# Altium schematic sheet Sheet_V2.SchDoc: Humidity Fan Controller
size A3; Author: Grzegorz Jabłoński; Revision: V2.0; SheetNumber: 1; SheetTotal: 1
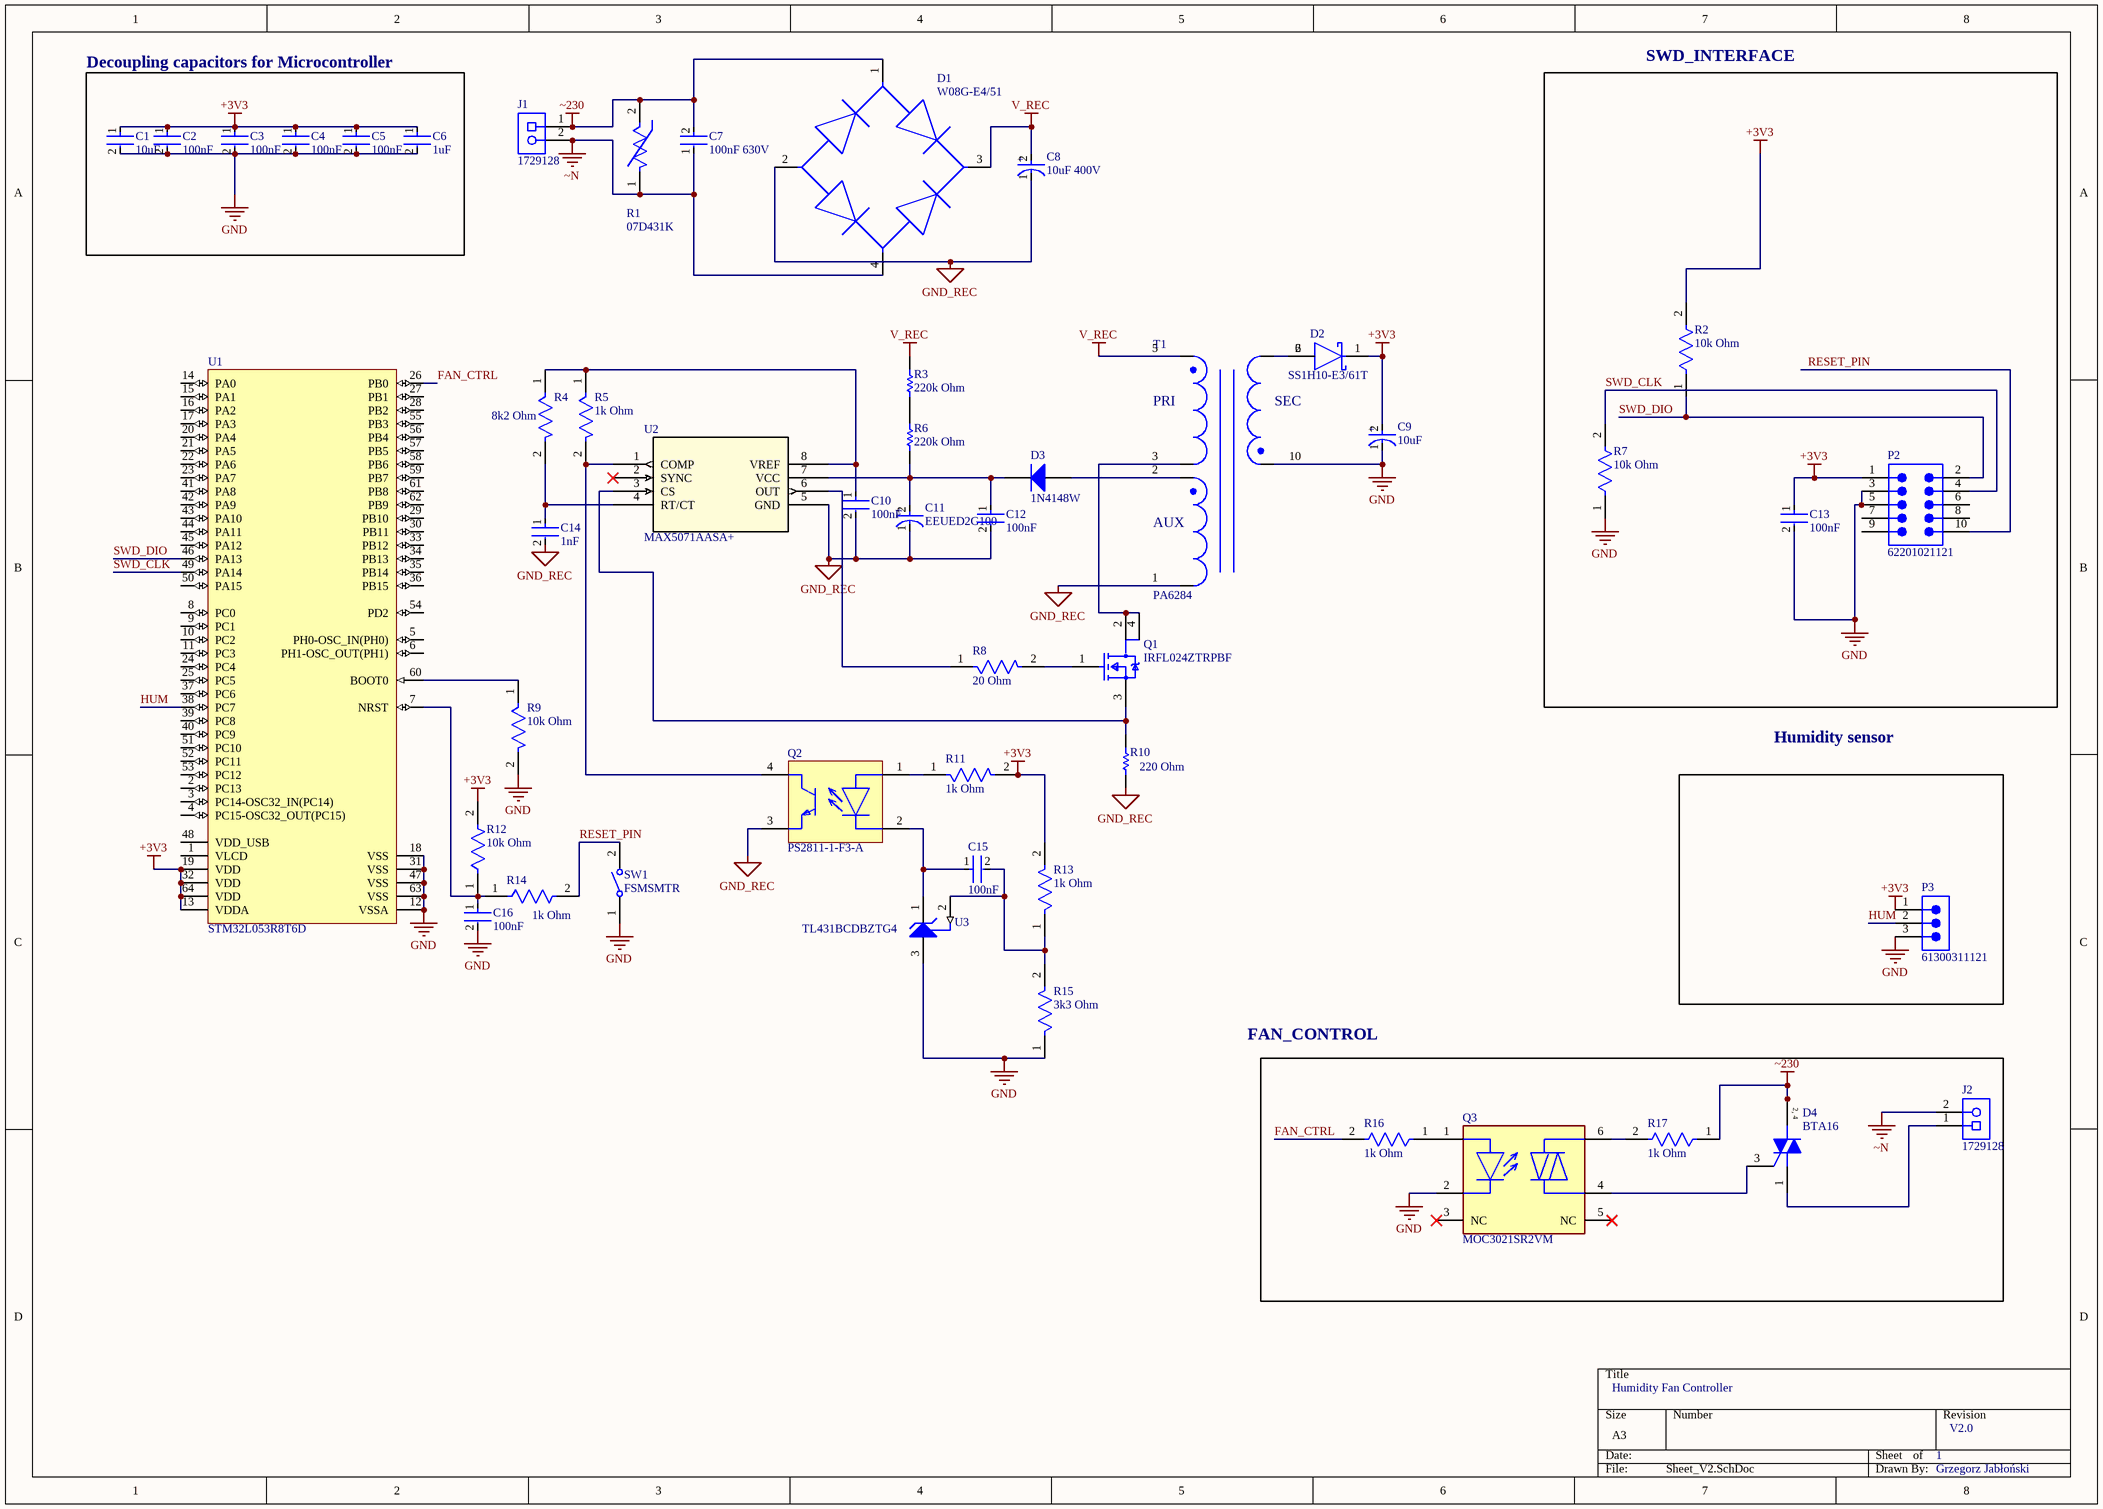
[diagram p0: Sheet_V2.SchDoc]

## Parts
C1  10uF  [FP-CC0805-0_85-MFG]
C2  100nF  [FP-CC0805-0_85-MFG]
C3  100nF  [FP-CC0805-0_85-MFG]
C4  100nF  [FP-CC0805-0_85-MFG]
C5  100nF  [FP-CC0805-0_85-MFG]
C6  1uF  [FP-CC0805-0_85-MFG]
C7  100nF 630V  [FP-BFC233620104-MFG]
C8  10uF 400V  [FP-RAD-TH-D_10_0_5-L_20_2-MFG]
C9  10uF  [FP-RAD-TH-D_6_3_0_5-L_7_1-MFG]
C10  100nF  [FP-CC0805-0_85-MFG]
C11  EEUED2G100  [FP-RAD-TH-D_10_0_5-L_20_2-MFG]
C12  100nF  [FP-CC0805-0_85-MFG]
C13  100nF  [FP-CC0805-0_85-MFG]
C14  1nF  [FP-CC0805-0_85-MFG]
C15  100nF  [FP-CC0805-0_85-MFG]
C16  100nF  [FP-CC0805-0_85-MFG]
D1  W08G-E4/51  [FP-WOG-MFG]
D2  SS1H10-E3/61T  [FP-95400-MFG]
D3  1N4148W  [DIOD-SOD123-2_V]
D4  BTA16  [ONSC-SOT-223-4-318E-04_V]
J1  1729128  [PHOE-1729128-2_V]
J2  1729128  [PHOE-1729128-2_V]
P2  62201021121  [62201021121]
P3  61300311121  [61300311121]
Q1  IRFL024ZTRPBF  [FP-PG-SOT223-3-MFG]
Q2  PS2811-1-F3-A  [SOP127P700X210_HS-5_SO4-Opto2_N]
Q3  MOC3021SR2VM  [FP-646BY-MFG]
R1  07D431K  [FP-B72207S0110K101-MFG]
R2  10k Ohm  [FP-RMCF0805-MFG]
R3  220k Ohm  [RESC3216X70X50NL20T25]
R4  8k2 Ohm  [FP-RMCF0805-MFG]
R5  1k Ohm  [FP-RMCF0805-MFG]
R6  220k Ohm  [RESC3216X70X50NL20T25]
R7  10k Ohm  [FP-RMCF0805-MFG]
R8  20 Ohm  [FP-RMCF0805-MFG]
R9  10k Ohm  [FP-RMCF0805-MFG]
R10  220 Ohm  [RESC3216X70X50NL05T20]
R11  1k Ohm  [FP-RMCF0805-MFG]
R12  10k Ohm  [FP-RMCF0805-MFG]
R13  1k Ohm  [FP-RMCF0805-MFG]
R14  1k Ohm  [FP-RMCF0805-MFG]
R15  3k3 Ohm  [FP-RMCF0805-MFG]
R16  1k Ohm  [FP-RMCF0805-MFG]
R17  1k Ohm  [FP-RMCF0805-MFG]
SW1  FSMSMTR  [TECO-FSMSMTR_V]
T1  PA6284  [ALD]
U1  STM32L053R8T6D  [STM-LQFP64_L]
U2  MAX5071AASA+  [21-0041_S8+4_MXM]
U3  TL431BCDBZTG4  [TI-DBZ3_N]

## Blocks framed on the sheet
Decoupling capacitors for Microcontroller: C1-C6
SWD_INTERFACE: C13 P2 R2 R7

## Nets
+3V3: C1.1 C2.1 C3.1 C4.1 C5.1 C6.1 C9.2(A) C13.1 D2.1(C) P2.1 P3.1 R2.2 R11.2 R12.2 R13.2 U1.13(VDDA) U1.19(VDD) U1.32(VDD) U1.64(VDD)
GND: C1.2 C2.2 C3.2 C4.2 C5.2 C6.2 C9.1(C) C13.2 C16.2 P2.3 P2.5 P3.3 Q3.2(C) R7.1 R9.2 R15.1 SW1.1 T1.10 U1.12(VSSA) U1.18(VSS) U1.31(VSS) U1.47(VSS) U1.63(VSS) U3.3(ANODE)
GND_REC: C8.1(C) C10.2 C11.1(C) C12.2 C14.2 D1.2(+) Q2.3(E) R10.1 T1.1 U2.5(GND)
V_REC: C8.2(A) D1.3(-) R3.2 T1.5
~230: C7.2 D1.1(1_~) D4.2(MT2) D4.4(MT2) J1.1 R1.2 R17.1
~N: C7.1 D1.4(2_~) J1.2 J2.2 R1.1
FAN_CTRL: R16.2 U1.26(PB0)
HUM: P3.2 U1.38(PC7)
RESET_PIN: P2.10 R14.2 SW1.2
SWD_CLK: P2.4 R7.2 U1.49(PA14)
SWD_DIO: P2.2 R2.1 U1.46(PA13)
NetC10_1: C10.1 R4.1 R5.1 U2.8(VREF)
NetC11_2: C11.2(A) C12.1 D3.2(K) R6.1 U2.7(VCC)
NetC14_1: C14.1 R4.2 U2.4(RT/CT)
NetC15_1: C15.1 Q2.2(C) U3.1(CATHODE)
NetC15_2: C15.2 R13.1 R15.2 U3.2(REF)
NetC16_1: C16.1 R12.1 R14.1 U1.7(NRST)
NetD2_2: D2.2(A) T1.6
NetD3_1: D3.1(A) T1.2
NetD4_1: D4.1(MT1) J2.1
NetD4_3: D4.3(G) Q3.4(1_MAIN_TERM)
NetQ1_1: Q1.1(GATE) R8.2
NetQ1_2: Q1.2(DRAIN) Q1.4(DRAIN) T1.3
NetQ1_3: Q1.3(SOURCE) R10.2 U2.3(CS)
NetQ2_1: Q2.1(A) R11.1
NetQ2_4: Q2.4(C) R5.2 U2.1(COMP)
NetQ3_1: Q3.1(A) R16.1
NetQ3_6: Q3.6(2_MAIN_TERM) R17.2
NetR3_1: R3.1 R6.2
NetR8_1: R8.1 U2.6(OUT)
NetR9_1: R9.1 U1.60(BOOT0)

Not connected (* = marked no-connect by the designer): P2 6 7 8 9; Q3 3(NC)* 5(NC)*; U1 1(VLCD) 2(PC13) 3(PC14-OSC32_IN(PC14)) 4(PC15-OSC32_OUT(PC15)) 5(PH0-OSC_IN(PH0)) 6(PH1-OSC_OUT(PH1)) 8(PC0) 9(PC1) 10(PC2) 11(PC3) 14(PA0) 15(PA1) 16(PA2) 17(PA3) 20(PA4) 21(PA5) 22(PA6) 23(PA7) 24(PC4) 25(PC5) 27(PB1) 28(PB2) 29(PB10) 30(PB11) 33(PB12) 34(PB13) 35(PB14) 36(PB15) 37(PC6) 39(PC8) 40(PC9) 41(PA8) 42(PA9) 43(PA10) 44(PA11) 45(PA12) 48(VDD_USB) 50(PA15) 51(PC10) 52(PC11) 53(PC12) 54(PD2) 55(PB3) 56(PB4) 57(PB5) 58(PB6) 59(PB7) 61(PB8) 62(PB9); U2 2(SYNC)*

## Notes on the sheet
- Humidity sensor
- FAN_CONTROL
- (in symbol CMP-1070-00032-1) 2, 4
- (in symbol CMP-05427-000412-1) +
- (in symbol CMP-05427-001613-1) +
- (in symbol PA6284) PRI; SEC; AUX

## Library data of the parts
C1 C6 C14 = CMP-2100-03606-3: CAP CER 0.1UF 50V X7R 0805; Manufacturer Part Number: CC0805KRX7R9BB104; Manufacturer: Yageo; Tolerance: 0.1; Capacitance: 100 nF; Value: 100 nF; Material: Ceramic; Device Class L1: Passive Components; ComponentLink2Description: Datasheet; Package: CC0805-0.85; Digikey Description: CAP CER 0.1UF 50V X7R 0805; Device Class L3: Ceramic Capacitors; Temperature: -30°C to +85°C; Temperature Characteristic: X7R; Voltage Rating: 50 V; Height: 0.95mm; RoHS: TRUE; Ipc Land Pattern Name: CAPC200125X85; Device Class L2: Capacitors; Category: Cap; Temperature Range Low: -30°C; Temperature Range High: +85°C; Mouser Description: Multilayer Ceramic Capacitors MLCC - SMD/SMT 100nF 50V X7R 10%; Footprint Url: http://www.yageo.com/exep/pages/download/literatures/UPY-C_GEN_24.pdf; Automotive: No; Octopart: https://octopart.com/cc0805krx7r9bb104-yageo-192993; Lead Free: Yes; ComponentLink2URL: http://www.yageo.com/documents/recent/UPY-GPHC_Y5V_6.3V-to-50V_8.pdf
C2-C5 C10 C12 C13 C15 C16 = CMP-2100-03606-3: CAP CER 0.1UF 50V X7R 0805; Manufacturer Part Number: CC0805KRX7R9BB104; Manufacturer: Yageo; Tolerance: 0.1; Material: Ceramic; Device Class L1: Passive Components; ComponentLink2Description: Datasheet; Package: CC0805-0.85; Digikey Description: CAP CER 0.1UF 50V X7R 0805; Capacitance: 100 nF; Device Class L3: Ceramic Capacitors; Value: 100 nF; Temperature: -30°C to +85°C; Temperature Characteristic: X7R; Voltage Rating: 50 V; Height: 0.95mm; RoHS: TRUE; Ipc Land Pattern Name: CAPC200125X85; Device Class L2: Capacitors; Category: Cap; Temperature Range Low: -30°C; Temperature Range High: +85°C; Mouser Description: Multilayer Ceramic Capacitors MLCC - SMD/SMT 100nF 50V X7R 10%; Footprint Url: http://www.yageo.com/exep/pages/download/literatures/UPY-C_GEN_24.pdf; Automotive: No; Octopart: https://octopart.com/cc0805krx7r9bb104-yageo-192993; Lead Free: Yes; ComponentLink2URL: http://www.yageo.com/documents/recent/UPY-GPHC_Y5V_6.3V-to-50V_8.pdf
C7 = CMP-02419-000009-1: CAP FILM 0.1UF 20% 630VDC RADIAL; Insulation Resistance: 15GR; Voltage: 250V; Voltage Rating (AC): 310V; Lead Diameter: 0.6mm; Dielectric: PP; Lead Free: Lead Free; Height - Seated (Max): 0.433inch; Radiation Hardening: No; Lead Pitch: 15mm; Width: 0.197inch; Height: 12mm; Package Quantity: 1000; Capacitance: 100nF; Packaging: Bulk; Termination: PC Pins; Case/Package: Radial; Contact Plating: Tin; Length: 17.5mm; Diameter: 6mm; Max Operating Temperature: 110°C; Mount: Through Hole; Min Operating Temperature: -55°C; Depth: 5mm; RoHS Compliant: Yes; Series: MKP336 2; Voltage Rating (DC): 630V; Tolerance: 20%; Construction: RADIAL; Dielectric Material: PP
C8 C11 = CMP-05427-001613-1: Aluminum Electrolytic Capacitors (Radial Lead Type) 10uF ±20% 400V; Lead Diameter: 0.6mm; Life (Hours): 8000Hour; Ripple Current (AC): 300mA; Dissipation Factor: 0.24%; Dielectric Material: Aluminium; Polarity: Polar; Voltage: 400V; Number of Pins: 2; Height: 20mm; Case/Package: Radial; REACH SVHC: No SVHC; Max Operating Temperature: 105°C; Construction: RADIAL; Voltage Rating (DC): 400V; Tolerance: 20%; Voltage Rating: 400V; Contact Plating: Tin; Ripple Current: 300mA; Min Operating Temperature: -25°C; Packaging: Bulk; Lead Free: Lead Free; Diameter: 10mm; Height - Seated (Max): 0.787inch; Radiation Hardening: No; Capacitance: 10uF; Termination: Radial; Length: 20mm; Series: ED; Package Quantity: 200; Mount: Through Hole; Lead Pitch: 5mm; RoHS Compliant: Yes
C9 = CMP-05427-000412-1: Aluminum Electrolytic Capacitors (Radial Lead Type) 15uF ±20% 35V; Ripple Current: 50mA; Ripple Current (AC): 35mA; Polarity: Polar; Leakage Current: 5.3uA; Life (Hours): 1000Hour; Min Operating Temperature: -55°C; Tolerance: 20%; Termination: Radial; RoHS Compliant: Yes; Mount: Through Hole; Package Quantity: 200; Series: GA; Lead Pitch: 2.5mm; Voltage Rating: 35V; Diameter: 6.3mm; REACH SVHC: No SVHC; Capacitance: 15uF; Packaging: Bulk; Case/Package: Radial; Number of Pins: 2; Height: 7mm; Max Operating Temperature: 105°C; Radiation Hardening: No; Voltage Rating (DC): 35V; Construction: RADIAL; Voltage: 35V; Length: 7mm; Height - Seated (Max): 0.276inch
D1 = CMP-00030-42174390-1: W08G-E4/51 Diode Rectifier Bridge Single 800V 1.5A 4-Pin Case WOG Bulk; Peak Reverse Current: 5µA; Number of Elements: 1; Forward Voltage: 1V; Max Surge Current: 50A; Capacitance: 14pF; Lead Free: Lead Free; Element Configuration: Single; Number of Pins: 4; Breakdown Voltage: 800V; Average Rectified Current: 1.5A; Width: 8.84mm; Max Repetitive Reverse Voltage (Vrrm): 800V; RoHS: Compliant; Length: 9.86mm; REACH SVHC: Unknown; NexarPartId: 42174390; Forward Current: 1.5A; Radiation Hardening: No; Height: 5.6mm; Diameter: 9mm; Min Operating Temperature: -55°C; Peak Non-Repetitive Surge Current: 50A; Schedule B: 8541100080, 8541100080; Max Reverse Leakage Current: 5µA; Max Operating Temperature: 150°C; Mount: Through Hole; Output Current: 1.5A
D2 = CMP-02539-000016-1: DIODE SCHOTTKY 100V 1A DO214AC; Manufacturer: Vishay; Standoff Height: 0mm; Max Junction Temp: +175°C; Max Surge Forward Current: 50A; Peak Reverse Current: 1uA; Package: 95400; Octopart: https://octopart.com/ss1h10-e3%2F61t-vishay-39552861; Device Class L2: Diodes; Automotive: No; Height: 2.29mm; Category: Diode; ComponentLink2Description: Datasheet; Forward Current: 1A; Reverse Voltage: 100V; Temperature Range High: +175°C; Lead Free: Yes; Device Class L3: Schottky Diodes; Manufacturer Part Number: SS1H10-E3/61T; ComponentLink2URL: http://www.vishay.com/docs/88747/ss1h9.pdf; Mouser Description: Schottky Diodes & Rectifiers 1.0 Amp 100 Volt; RoHS: TRUE; Digikey Description: DIODE SCHOTTKY 100V 1A DO214AC; Footprint Url: http://www.vishay.com/docs/95400/sma.pdf; Device Class L1: Discrete Semiconductors; Max Repetitive Reverse Voltage: 100V; Temperature: to +175°C
D3 = CMP-2000-04932-2: Fast Switching Diode, 100 V, 0.15 A, -65 to 150 degC, 2-Pin?SOD123, RoHS, Tape and Reel; Recovery Time: 4ns; Brand: DiodesIncorporated; Unit Weight: 0.000353oz; Max Surge Current: 2A; Peak Reverse Voltage: 100V; Ir - Reverse Current: 1uA; Vf - Forward Voltage: 1.25V; Configuration: Single; If - Forward Current: 0.15A; Product Category: Diodes-GeneralPurpose,Power,Switching; Operating Temperature Range: -65Cto+150C; Packaging: Reel; Manufacturer URL: http://www.diodes.com/; Maximum Operating Temperature: +150C; Height: 1.25mm; Minimum Operating Temperature: -65C; Product: SwitchingDiodes; Package URL: http://www.diodes.com/datasheets/ds18004.pdf; Type: SwitchingDiode; Package Reference: SOD123-2; Width: 1.7mm; Datasheet URL: http://www.farnell.com/datasheets/1915529.pdf; Datasheet Version: Rev. 24-2, 10/2013; Series: 1N4148; Factory Pack Quantity: 3000; Length: 2.85mm; RoHS: True; Manufacturer: DiodesIncorporated; Mounting Style: SMD/SMT; Package / Case: SOD-123
D4 = CMP-1070-00032-1: Sensitive Gate Triac Series, Silicon Bidirectional Thyristor, 4-Pin SOT-223, Pb-Free, Tape and Reel; Manufacturer: On Semiconductor; PartNumber: Z0107MNT1G; ITSM Max (A): 8; IT(RMS) Max (A): 1; PackageVersion: Rev. N, 08/2009; ComponentLink3URL: http://www.onsemi.com/pub_link/Collateral/318E-04.PDF; Packing: Tape and Reel; ComponentLink1Description: Manufacturer URL; ComponentLink3Description: Package Specification; DatasheetVersion: Rev. 3; ComponentLink2Description: Datasheet; PackageDescription: 4-Pin Small Outline Transistor, Body 6.5 x 3.5 mm, Pitch 2.3 mm; PackageReference: SOT-223-4-318E-04; ComponentLink1URL: http://www.onsemi.com/; ComponentLink2URL: http://www.onsemi.com/pub_link/Collateral/Z0103MN-D.PDF; RoHS: Pb-Free; Mounting Technology: Surface Mount
J1 J2 = CMP-2000-05815-1: PCB Terminal Block, 13.5 A, 400 V, 2-Pin THD, RoHS, Bulk; Manufacturer: Phoenix Contact; Package Version: 03/2015; No. of Rows: 1; Pitch: 5.08mm; No. of Positions: 2; Voltage Rating: 400V; Current Rating: 13500mA; Manufacturer URL: http://www.phoenixcontact.com/; Datasheet URL: https://datasheet.ciiva.com/16046/1729128-16046181.pdf; RoHS: TRUE; Package URL: https://www.phoenixcontact.com/online/portal/pi/pxc/product_detail_page/!ut/p/b1/3VdJjqNKFDxLH8AFycySyWY2ozFsEPOMMQaDOX1XedGL_1Vdm5YXJleknhSKeBkvI6EA8ncAo3AYoDhBQGco6KN7VURTdemj9us_IEKEZo_YHiPAEWEFmDGOHMORkqKYCORBZxgL7ZoaZYcbFFUZ3fqxSY6GOuxydWUuHqz1ynmMFygu583Bob0Ewr6Sd_l-5m-kAueHiB0jpRwZwe58wwtkpxtMYd_LmGcDRU02dRNEyWt6Y2ti5pSyJ_reIkzIulrqApdnbT11V5jnCKbYNCvhEM1MCpPByat_X379-iThf08CI5GfOPqfBeS3BRoBOdD55AKVv0iLwCMq-2BrzXWSGRH7pUGD9uwXQjiph3xL0DKQwdGa0JImiIOmBNOestqgwTHSSs2oOep-78apyXQBvNi8ZLaFjvjWvcaUEBu0MC6Wbe-d6mB0FAebo2lUWinqYaZs5DAYzV0RP9yitUjnGJ0iI9xhZkT42OCQNUJJhkgWINNQLP2JFP6OpMg3JCVg70jqHT0lvKOnhHf0lPuOnnLf0VPuWx6_dxwUIvwk5WMkT0kLL1mh61l2yZVSzG3pYV_bqo-mj6uMKwKwdnnW8Jh5RTOJzMOA5c-eJDaZQw4mTMPH02PvS_ZAqNVjVTo2WyYLkwH_KU1mmmG5kjRhDqPXLwwVHvVOjCM60-fpXvTDfMGW1PVFVS1r4e4yVDk4ZdNbkUHvqPqQSeian4UD39fNKmachqdJ1NJbyk8rXT9mXTvPk3oE5meulKGgiruPJek-4I9hTT6G8ZLOyRSm2RRVbThERQad5OS28hdt4YW4vG0stgYYzsWsK4_7y6DZMjJSCqri1kyiZR5vD7pwIrNR7QwPHTcLTI5qT7eRlpHrdGiupYlqQDJ7zy_CND8fWWBoLRXxk1RVcXiBQwbTD4Xi7KL-FuO94t9xaqweXzH; PartNumber: 1729128; Package Description: 2-Pin Through Hole Device, Body 8.1 x 10.16 mm, Pitch 5.08 mm; Datasheet Version: 12/2013; Mounting Technology: ThroughHole; Orientation: Horizontal; Package Reference: 1729128-2; Packing: Bulk
P2 = CMP-1502-00948-3: NexarPartId: 32855586; Pitch: 1.27mm; Operating Supply Voltage: 100V; Connector Type: Male Pin; Contact Resistance: 20mΩ; Current Rating: 1A; Number of Contacts: 10; Gender: Male; Contact Mating Length: 3.81mm; Max Operating Temperature: 105°C; Mount: Through Hole; Number of Pins: 10; Row Spacing: 1.27mm; Lead Pitch: 1.27mm; REACH SVHC: Unknown; Min Operating Temperature: -40°C; Contact Material: Copper; Orientation: Vertical; Contact Plating: Gold; Number of Rows: 2; RoHS: Compliant; Packaging: Box; Voltage Rating: 100V; Color: Black; Height: 5.65mm; Termination: Solder; Number of Positions: 10
P3 = CMP-1502-01062-3: NexarPartId: 32855521; Current Rating: 3A; Voltage Rating: 250V; Number of Positions: 3; Pitch: 2.54mm; Contact Resistance: 20mΩ; Connector Type: Male Pin; Gender: Male; REACH SVHC: Unknown; Packaging: Bulk; Contact Material: Copper; Min Operating Temperature: -40°C; Number of Rows: 1; Orientation: Vertical; RoHS: Compliant; Contact Plating: Gold; Max Operating Temperature: 105°C; Mount: Through Hole; Height: 8.94mm; Operating Supply Voltage: 250V; Number of Pins: 3; Contact Mating Length: 5.9944mm; Number of Contacts: 3; Color: Black; Lead Free: Lead Free; Lead Pitch: 2.54mm; Termination: Solder
Q1 = CMP-32901-000392-1: MOSFET N-CH 55V 5.1A SOT223; Rds On Max: 57.5mR; Turn-On Delay Time: 7.8ns; Turn-Off Delay Time: 30ns; Input Capacitance: 340pF; Power Dissipation: 2.8W; Max Power Dissipation: 1W; Gate to Source Voltage (Vgs): 20V; Width: 0.146inch; RoHS Compliant: Yes; Max Operating Temperature: 150°C; Height: 0.057inch; Halogen Free: Halogen Free; Continuous Drain Current (ID): 5.1A; Packaging: Tape and Reel; Lead Free: Contains Lead; Max Dual Supply Voltage: 55V; Mount: Surface Mount; Drain to Source Voltage (Vdss): 55V; Case/Package: SOT-223; Drain to Source Resistance: 57.5mR; Length: 0.263inch; Min Operating Temperature: -55°C; Number of Pins: 3
Q2 = CMP-00572-23028373-2: Optocoupler DC-IN 1-CH Transistor DC-OUT 4-Pin SSOP Embossed T/R; Manufacturer Lifecycle Status: ACTIVE; Max Input Current: 1A; Collector Emitter Saturation Voltage: 300mV; Current Transfer Ratio: 400%; Number of Circuits: 1; Forward Voltage: 1.4V; Max Power Dissipation: 120mW; Rise Time: 4µs; Max Collector Current: 40mA; Output Voltage: 40V; Forward Current: 50mA; Input Current: 5mA; Isolation Voltage: 2.5kV; Reverse Breakdown Voltage: 6V; ComponentLink1Description: Manufacturer's Website; Packaging: Cut Tape; RoHS: Compliant; Case/Package: SSOP; HelpURL: https://octopart.com/cad-content/api/get-model-datasheet/15189/23028373; Lead Free: Lead Free; Min Operating Temperature: -55°C; Height: 2.1mm; Number of Elements: 1; China RoHS: Compliant; Mount: Surface Mount; Number of Channels: 1; Lifecycle Status: Production; ComponentLink2URL: https://octopart.com/cad-content/api/get-model-datasheet/15189/23028373; Number of Pins: 4; Radiation Hardening: No; Collector Emitter Voltage (VCEO): 40V; ComponentLink2Description: Datasheet URL; ComponentLink1URL: http://www.renesas.com; REACH SVHC: No SVHC; Max Operating Temperature: 100°C
Q3 = CMP-00278-84330366-1: MOC3021SR2VM Triac Driver Output Optocoupler, 6-Pin DIP 400V Random Phase; Manufacturer Lifecycle Status: ACTIVE; Isolation Voltage: 7.5kV; Power Dissipation: 330mW; Hold Current: 100µA; Number of Circuits: 1; Approvals: EN, IEC, UL; Input Current: 60mA; Nominal Input Voltage: 1.15V; Reverse Breakdown Voltage: 3V; Max Input Voltage: 1.5V; Max Operating Temperature: 85°C; Weight: 810mg; Mount: Surface Mount; REACH SVHC: No SVHC; Case/Package: SMD/SMT; NexarPartId: 84330366; RoHS: Compliant; Lead Free: Lead Free; Schedule B: 8541408000, 8541408000; Number of Elements: 1; Number of Channels: 1; Packaging: Digi-Reel®; Forward Voltage: 1.15V; Forward Current: 60mA; Number of Pins: 6; Radiation Hardening: No; Output Voltage: 400V; Max Power Dissipation: 330mW; Lifecycle Status: Production; Min Operating Temperature: -40°C
R1 = CMP-10618-000012-1: VARISTOR 18V 250A DISC 7MM; Manufacturer: EPCOS; Manufacturer Part Number: B72207S0110K101; Voltage Rating Ac: 11V; Voltage Rating Dc: 14V; Clamping Voltage: 36V; Capacitance: 2750pF; Clamping Current: 2.5A; Value: 2750pF; Voltage Tolerance: 10%; ComponentLink2URL: https://product.tdk.com/info/en/documents/data_sheet/70/db/var/SIOV_Leaded_StandarD.pdf; Device Class L2: Varistors; Temperature: -40°C to +105°C; ComponentLink2Description: Datasheet; Device Class L3: unset; Lead Free: Yes; Package: B72207S0110K101; Automotive: No; Height: 11mm; Temperature Range Low: -40°C; RoHS: TRUE; Device Class L1: Circuit Protection; Varistor Voltage: 18V; Temperature Range High: +105°C; Octopart: https://octopart.com/b72207s0110k101-epcos-11931358; Category: Res; Mouser Description: Varistor: metal-oxide; THT; 11VAC; 14VDC; 18V; 250A; 800mJ; Digikey Description: VARISTOR 18V 250A DISC 7MM
R2 R4 R5 R7-R9 R11-R17 = CMP-26527-000017-1: RES 0 OHM JUMPER 1/8W 0805; Power Rating: 125mW; Resistance: 0mR; Depth: 1.25mm; Length: 2mm; Military Standard: Not; Width: 0.049inch; Case Code (Imperial): 0805; Number of Terminations: 2; Mount: Surface Mount; Contact Plating: Tin; Height: 0.026inch; Case/Package: 0805; Min Operating Temperature: -55°C; Composition: Thick Film; Max Operating Temperature: 155°C; Packaging: Tape and Reel; Features: Automotive AEC-Q200; Max Power Dissipation: 125mW; Radiation Hardening: No; Lead Free: Lead Free; Case Code (Metric): 2012
R3 R6 = CMP-2003-04437-1: Part Number: ERA8AEB204V; Manufacturer: Panasonic
R10 = CMP-2003-00807-1: Manufacturer: Panasonic; Part Number: ERJ8ENF1200V
SW1 = CMP-2000-07501-1: FSMSM Push Button Switch, 50 mA, -35 to 85 degC, 2-Pin SMD, RoHS, Tape and Reel; Manufacturer: TE Connectivity; Voltage Rating (DC): 24V; Electrical Life: 20000Cycles; Operating Force: 180gf; Switch Travel: 0.25mm; Contact Current Rating: 50mA; Case\/Package: SMD/SMT; Actuator Length: 1.07mm; Throw Configuration: SPST; Actuator Material: Polyamide; Contact Resistance: 100mOhm; Illumination Type: Illuminated; Max Voltage Rating (DC): 12V; Manufacturer URL: http://www.te.com/; Lead Free: LeadFree; Packaging: TapeandReel; Min Operating Temperature: -35degC; Mechanical Life: 20000Cycles; Mount: SurfaceMount; REACH SVHC: Unknown; Package Quantity: 1800; Package Reference: FSMSMTR; RoHSCompliant: true; Max Operating Temperature: 85degC; Orientation: Straight; ELV: Compliant; Datasheet URL: http://www.te.com/commerce/DocumentDelivery/DDEController?Action=showdoc&DocId=Customer+Drawing%7F1437566-3%7FC2%7Fpdf%7FEnglish%7FENG_CD_1437566-3_C2_1437566_3_1_c.dwg.pdf%7F1437566-4; Package Description: 2-Pin Surface Mount Device, Body 6 x 3.5 mm, Pitch 9.19 mm; Current Rating: 50mA; Contact Plating: Silver; Termination: GullWing; Datasheet Version: Rev. C2, 08/2014; Contact Material: Brass; Mounting Technology: SurfaceMount
T1 = PA6284: PA6284 Flyback Transformer
U1 = CMP-1546-00063-2: Ultra-low-power 32-Bit MCU ARM-based Cortex-M0+, 64 KB Flash, 8 KB RAM, 51 I/Os, 64-Pin LQFP, -40 to 85 degC, Tray; I/Os (High Current): 51; Core: ARM Cortex-M0+; FLASH Size (Prog) (kB): 64; Internal RAM Size (kB): 8; D/A Converter: 1; Operating Frequency(F) (Processor speed) (MHz): 32; Supply Voltage(Vcc) min (V): 1.65; Data E2PROM nom (B): 2048; Package Description: 64-Pin Low-profile Quad Flat Package, Body 10 x 10 mm, Pitch 0.5 mm; ComponentLink2URL: http://www.st.com/st-web-ui/static/active/en/resource/technical/document/datasheet/DM00105960.pdf; Package Reference: LQFP64; ComponentLink1URL: http://www.st.com/; Packing: Tray; ComponentLink1Description: Manufacturer URL; ComponentLink2Description: Datasheet; DatasheetVersion: Rev. 5; Mounting Technology: Surface Mount
U2 = MAX5071AASA+: No Description Available; Mfr_Name: Analog Devices Inc; RefDes: RefDes; Type: Type
U3 = CMP-0366-01234-1: Adjustable Precision Shunt Regulator, 34 ppm / degC, 100 mA, 0 to 70 degC, 3-pin SOT-23 (DBZ), Green (RoHS & no Sb/Br); Manufacturer: Texas Instruments; Rating: Catalog; VO Adj(Min)(V): 2.495; Min Iz for Regulation(uA): 600; Iout/Iz(Max)(mA): 100; Temp Coeff(Typ)(ppm/ degree C): 34; Temp Coeff(Max)(ppm/ degree C): 92; SubFamily: Shunt Voltage Reference; VO Adj(Max)(V): 36; Initial Accuracy @ 25/deg C(%): 0.5; PartNumber: TL431BCDBZTG4; ComponentLink1Description: Manufacturer URL; ComponentLink2Description: Datasheet; ComponentLink1URL: http://www.ti.com/; DatasheetVersion: SLVS543M; Code_JEDEC: TO-236; Eco-Plan: Green (RoHS & no Sb/Br); ComponentLink2URL: http://www.ti.com/general/docs/lit/getliterature.tsp?genericPartNumber=TL431B&fileType=pdf; ComponentLink3URL: http://www.ti.com/litv/pdf/mpds108a; PackageReference: DBZ3; ComponentLink3Description: Package Specification; PackageVersion: 4203227/B; PackageDescription: 3-Pin Plastic Small Outline, Body 2.92 x 1.3 mm, Pitch 0.95 mm; Mounting Technology: Surface Mount